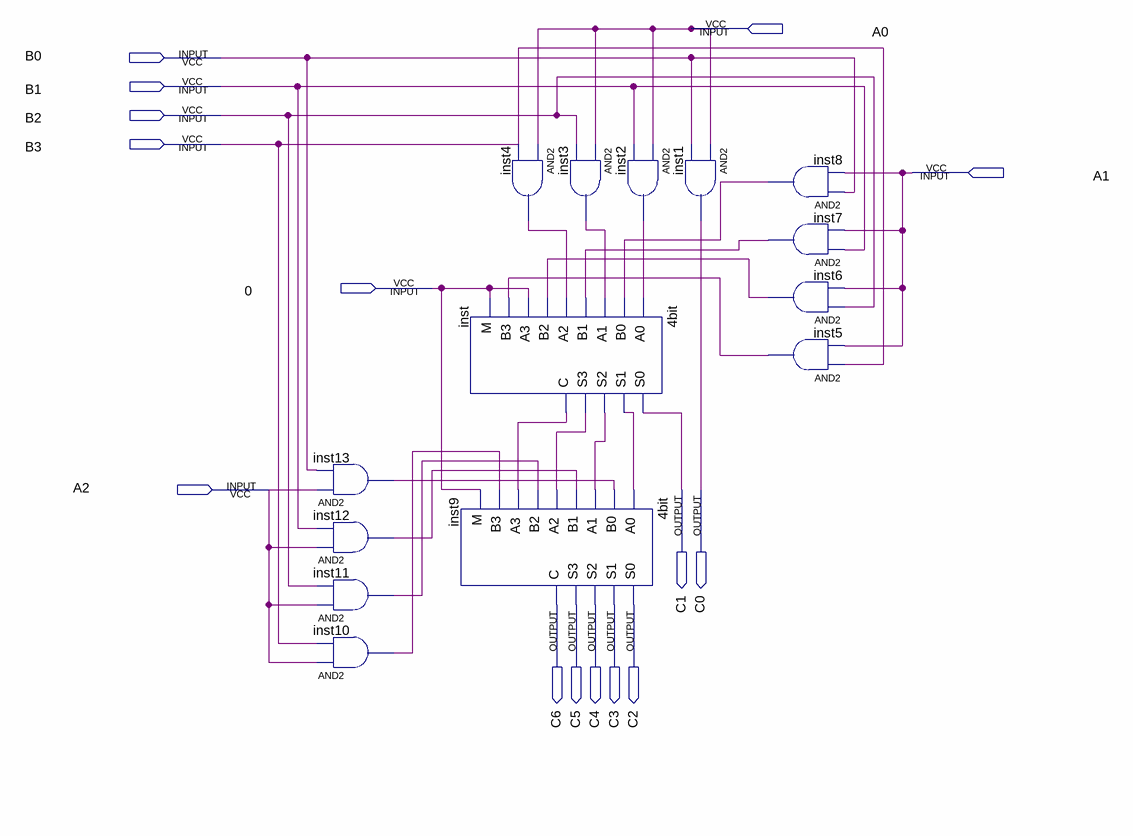
[diagram p0: schematic sheet]
// Quartus schematic s1111408_lab03b.bdf as structural Verilog: 14 symbols, 15 pins
module s1111408_lab03b (
  input  A0,
  input  B0,
  input  B1,
  input  B2,
  input  B3,
  input  A1,
  input  \0 ,
  input  A2,
  output C1,
  output C0,
  output C6,
  output C5,
  output C4,
  output C3,
  output C2
);

  wire inst2_out, inst3_out, inst4_out, inst5_out, inst6_out, inst7_out, inst8_out, inst10_out, inst11_out,
       inst12_out, inst13_out, inst_c, inst_s1, inst_s2, inst_s3;

  and inst13 (inst13_out, A2, B0);
  and inst12 (inst12_out, A2, B1);
  and inst11 (inst11_out, A2, B2);
  and inst10 (inst10_out, A2, B3);
  and inst4 (inst4_out, A0, B3);
  \4bit  inst (
    .A0(inst2_out), .B0(inst8_out), .A1(inst3_out), .B1(inst7_out), .A2(inst4_out), .B2(inst6_out), .A3(\0 ),
    .B3(inst5_out), .M(\0 ), .S0(C1), .S1(inst_s1), .S2(inst_s2), .S3(inst_s3), .C(inst_c));
  \4bit  inst9 (
    .A0(inst_s1), .B0(inst13_out), .A1(inst_s2), .B1(inst12_out), .A2(inst_s3), .B2(inst11_out), .A3(inst_c),
    .B3(inst10_out), .M(\0 ), .S0(C2), .S1(C3), .S2(C4), .S3(C5), .C(C6));
  and inst3 (inst3_out, A0, B2);
  and inst2 (inst2_out, A0, B1);
  and inst1 (C0, A0, B0);
  and inst8 (inst8_out, B0, A1);
  and inst7 (inst7_out, B1, A1);
  and inst6 (inst6_out, B2, A1);
  and inst5 (inst5_out, B3, A1);
endmodule
